# EAGLE schematic sonar_preprocessor (EAGLE 8.3.2)

## Sheet 1 of 7: Amplifier
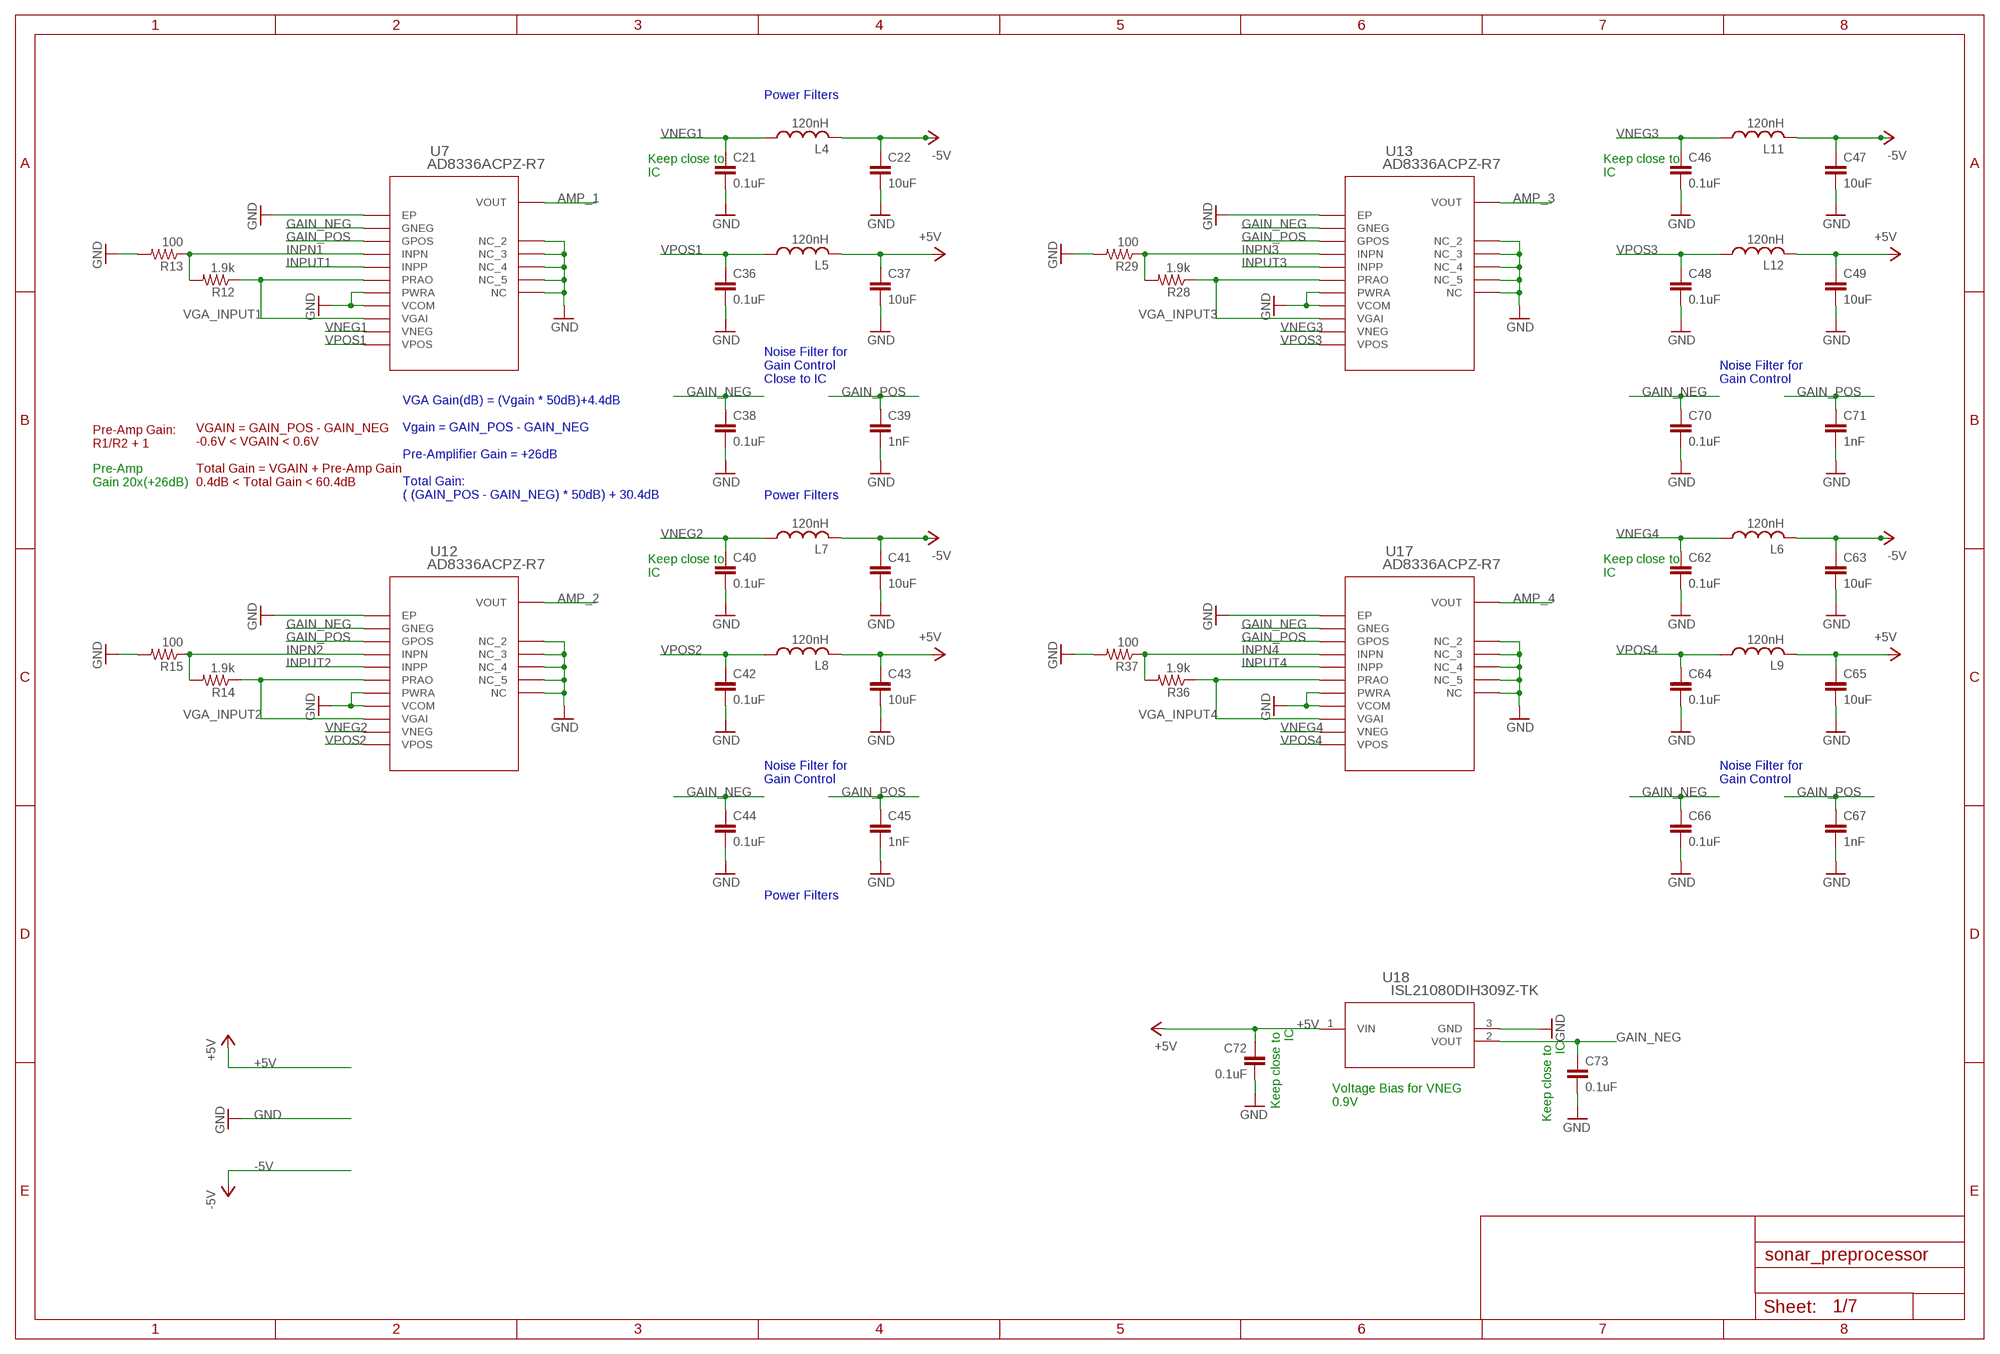
[diagram p0: schematic, sheet 1]

### Parts
C21  0.1uF  C-EUC0603  [C0603]
C22  10uF  C-EUC1206  [C1206]
C36  0.1uF  C-EUC0603  [C0603]
C37  10uF  C-EUC1206  [C1206]
C38  0.1uF  C-EUC0603  [C0603]
C39  1nF  C-EUC0603  [C0603]
C40  0.1uF  C-EUC0603  [C0603]
C41  10uF  C-EUC1206  [C1206]
C42  0.1uF  C-EUC0603  [C0603]
C43  10uF  C-EUC1206  [C1206]
C44  0.1uF  C-EUC0603  [C0603]
C45  1nF  C-EUC0603  [C0603]
C46  0.1uF  C-EUC0603  [C0603]
C47  10uF  C-EUC1206  [C1206]
C48  0.1uF  C-EUC0603  [C0603]
C49  10uF  C-EUC1206  [C1206]
C62  0.1uF  C-EUC0603  [C0603]
C63  10uF  C-EUC1206  [C1206]
C64  0.1uF  C-EUC0603  [C0603]
C65  10uF  C-EUC1206  [C1206]
C66  0.1uF  C-EUC0603  [C0603]
C67  1nF  C-EUC0603  [C0603]
C70  0.1uF  C-EUC0603  [C0603]
C71  1nF  C-EUC0603  [C0603]
C72  0.1uF  C-EUC0603  [C0603]
C73  0.1uF  C-EUC0603  [C0603]
L4  120nH  L-USL3225P  [L3225P]
L5  120nH  L-USL3225P  [L3225P]
L6  120nH  L-USL3225P  [L3225P]
L7  120nH  L-USL3225P  [L3225P]
L8  120nH  L-USL3225P  [L3225P]
L9  120nH  L-USL3225P  [L3225P]
L11  120nH  L-USL3225P  [L3225P]
L12  120nH  L-USL3225P  [L3225P]
R12  1.9k  R-US_R0603  [R0603]
R13  100  R-US_R0603  [R0603]
R14  1.9k  R-US_R0603  [R0603]
R15  100  R-US_R0603  [R0603]
R28  1.9k  R-US_R0603  [R0603]
R29  100  R-US_R0603  [R0603]
R36  1.9k  R-US_R0603  [R0603]
R37  100  R-US_R0603  [R0603]
U7  AD8336ACPZ-R7  [CP_16_4]
U12  AD8336ACPZ-R7  [CP_16_4]
U13  AD8336ACPZ-R7  [CP_16_4]
U17  AD8336ACPZ-R7  [CP_16_4]
U18  ISL21080DIH309Z-TK  [P3_064]

### Nets
+5V: C37.1 C43.1 C49.1 C65.1 C72.1 L5.2 L8.2 L9.2 L12.2 U18.1(VIN) ; also sheet 2,3,4,5,6,7
-5V: C22.1 C41.1 C47.1 C63.1 L4.2 L6.2 L7.2 L11.2 ; also sheet 2,5,6,7
AMP_1: U7.VOUT ; also sheet 2,6
AMP_2: U12.VOUT ; also sheet 2,6
AMP_3: U13.VOUT ; also sheet 2,6
AMP_4: U17.VOUT ; also sheet 2,6
GAIN_NEG: C38.1 C44.1 C66.1 C70.1 C73.1 U7.GNEG U12.GNEG U13.GNEG U17.GNEG U18.2(VOUT)
GAIN_POS: C39.1 C45.1 C67.1 C71.1 U7.GPOS U12.GPOS U13.GPOS U17.GPOS ; also sheet 6
GND: C21.2 C22.2 C36.2 C37.2 C38.2 C39.2 C40.2 C41.2 C42.2 C43.2 C44.2 C45.2 C46.2 C47.2 C48.2 C49.2 C62.2 C63.2 C64.2 C65.2 C66.2 C67.2 C70.2 C71.2 C72.2 C73.2 R13.2 R15.2 R29.2 R37.2 U7.GND1(EP) U7.NC U7.NC1(NC_2) U7.NC2(NC_3) U7.NC3(NC_4) U7.NC4(NC_5) U7.PWRA U7.VCOM U12.GND1(EP) U12.NC U12.NC1(NC_2) U12.NC2(NC_3) U12.NC3(NC_4) U12.NC4(NC_5) U12.PWRA U12.VCOM U13.GND1(EP) U13.NC U13.NC1(NC_2) U13.NC2(NC_3) U13.NC3(NC_4) U13.NC4(NC_5) U13.PWRA U13.VCOM U17.GND1(EP) U17.NC U17.NC1(NC_2) U17.NC2(NC_3) U17.NC3(NC_4) U17.NC4(NC_5) U17.PWRA U17.VCOM U18.3(GND) ; also sheet 2,3,4,5,6,7
INPN1: R12.2 R13.1 U7.INPN
INPN2: R14.2 R15.1 U12.INPN
INPN3: R28.2 R29.1 U13.INPN
INPN4: R36.2 R37.1 U17.INPN
INPUT1: U7.INPP ; also sheet 6,7
INPUT2: U12.INPP ; also sheet 6,7
INPUT3: U13.INPP ; also sheet 6,7
INPUT4: U17.INPP ; also sheet 6,7
VGA_INPUT1: R12.1 U7.PRAO U7.VGAI
VGA_INPUT2: R14.1 U12.PRAO U12.VGAI
VGA_INPUT3: R28.1 U13.PRAO U13.VGAI
VGA_INPUT4: R36.1 U17.PRAO U17.VGAI
VNEG1: C21.1 L4.1 U7.VNEG
VNEG2: C40.1 L7.1 U12.VNEG
VNEG3: C46.1 L11.1 U13.VNEG
VNEG4: C62.1 L6.1 U17.VNEG
VPOS1: C36.1 L5.1 U7.VPOS
VPOS2: C42.1 L8.1 U12.VPOS
VPOS3: C48.1 L12.1 U13.VPOS
VPOS4: C64.1 L9.1 U17.VPOS

### Notes on the sheet
- Power Filters
- Keep close to 
  IC
- Keep close to 
  IC
- Noise Filter for
  Gain Control
  Close to IC
- Noise Filter for
  Gain Control
- Pre-Amp Gain:
  R1/R2 + 1
- Pre-Amp 
  Gain 20x(+26dB)
- VGAIN = GAIN_POS - GAIN_NEG
  -0.6V < VGAIN < 0.6V
  
  Total Gain = VGAIN + Pre-Amp Gain
  0.4dB < Total Gain < 60.4dB
- VGA Gain(dB) = (Vgain * 50dB)+4.4dB
  
  Vgain = GAIN_POS - GAIN_NEG
  
  Pre-Amplifier Gain = +26dB
  
  Total Gain:
  ( (GAIN_POS - GAIN_NEG) * 50dB) + 30.4dB
- Power Filters
- Keep close to 
  IC
- Keep close to 
  IC
- Noise Filter for
  Gain Control
- Noise Filter for
  Gain Control
- Power Filters
- Keep close to 
  IC
- Keep close to 
  IC
- Voltage Bias for VNEG
  0.9V

## Sheet 2 of 7: Filter
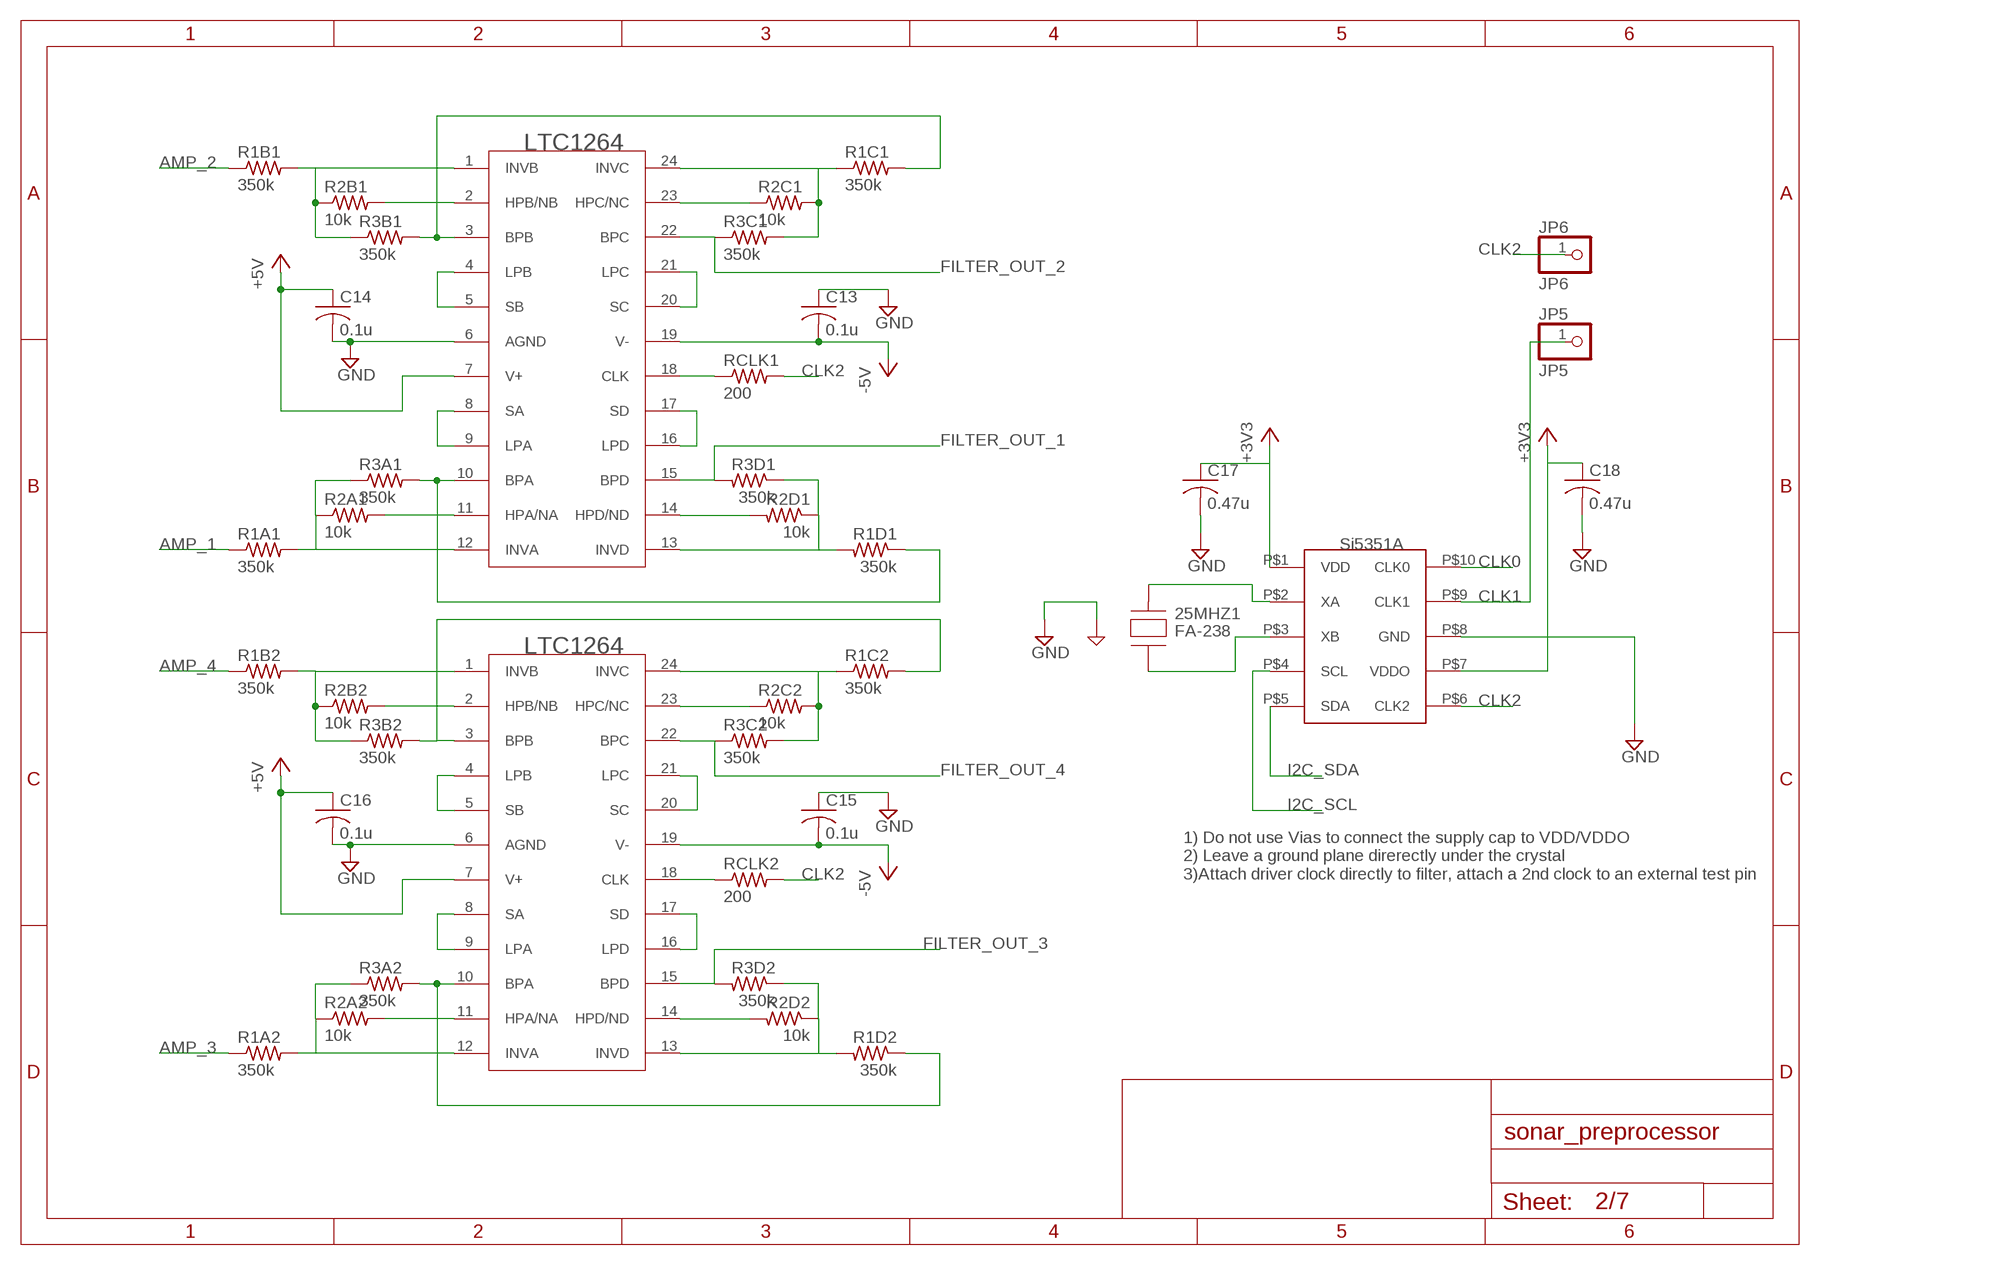
[diagram p1: schematic, sheet 2]

### Parts
25MHZ1  FA-238  [FA-238]
C13  0.1u  C-USC0805  [C0805]
C14  0.1u  C-USC0805  [C0805]
C15  0.1u  C-USC0805  [C0805]
C16  0.1u  C-USC0805  [C0805]
C17  0.47u  C-USC0805  [C0805]
C18  0.47u  C-USC0805  [C0805]
JP5  JP5  PINHD-1X1  [1X01]
JP6  JP6  PINHD-1X1  [1X01]
R1A1  350k  R-US_R0805  [R0805]
R1A2  350k  R-US_R0805  [R0805]
R1B1  350k  R-US_R0805  [R0805]
R1B2  350k  R-US_R0805  [R0805]
R1C1  350k  R-US_R0805  [R0805]
R1C2  350k  R-US_R0805  [R0805]
R1D1  350k  R-US_R0805  [R0805]
R1D2  350k  R-US_R0805  [R0805]
R2A1  10k  R-US_R0805  [R0805]
R2A2  10k  R-US_R0805  [R0805]
R2B1  10k  R-US_R0805  [R0805]
R2B2  10k  R-US_R0805  [R0805]
R2C1  10k  R-US_R0805  [R0805]
R2C2  10k  R-US_R0805  [R0805]
R2D1  10k  R-US_R0805  [R0805]
R2D2  10k  R-US_R0805  [R0805]
R3A1  350k  R-US_R0805  [R0805]
R3A2  350k  R-US_R0805  [R0805]
R3B1  350k  R-US_R0805  [R0805]
R3B2  350k  R-US_R0805  [R0805]
R3C1  350k  R-US_R0805  [R0805]
R3C2  350k  R-US_R0805  [R0805]
R3D1  350k  R-US_R0805  [R0805]
R3D2  350k  R-US_R0805  [R0805]
RCLK1  200  R-US_R0805  [R0805]
RCLK2  200  R-US_R0805  [R0805]
U$6  LTC1264SMD  [SO24W]
U$7  LTC1264SMD  [SO24W]
U$8  SI5351A  [MSOP-10]

### Nets
+3V3: C17.1 C18.1 U$8.P$1(VDD) U$8.P$7(VDDO) ; also sheet 6
+5V: C14.1 C16.1 U$6.7(V+) U$7.7(V+) ; also sheet 1,3,4,5,6,7
-5V: C13.2 C15.2 U$6.19(V-) U$7.19(V-) ; also sheet 1,5,6,7
AMP_1: R1A1.1 ; also sheet 1,6
AMP_2: R1B1.1 ; also sheet 1,6
AMP_3: R1A2.1 ; also sheet 1,6
AMP_4: R1B2.1 ; also sheet 1,6
CLK0: U$8.P$10(CLK0)
CLK1: JP5.1 U$8.P$9(CLK1)
CLK2: JP6.1 RCLK1.2 RCLK2.2 U$8.P$6(CLK2)
FILTER_OUT_1: R3D1.2 U$6.15(BPD) ; also sheet 3,6
FILTER_OUT_2: R3C1.1 U$6.22(BPC) ; also sheet 3,6
FILTER_OUT_3: R3D2.2 U$7.15(BPD) ; also sheet 3,6
FILTER_OUT_4: R3C2.1 U$7.22(BPC) ; also sheet 3,6
GND: 25MHZ1.P$1(GND) 25MHZ1.P$3(GND) C13.1 C14.2 C15.1 C16.2 C17.2 C18.2 U$6.6(AGND) U$7.6(AGND) U$8.P$8(GND) ; also sheet 1,3,4,5,6,7
I2C_SCL: U$8.P$4(SCL) ; also sheet 6
I2C_SDA: U$8.P$5(SDA) ; also sheet 6
N$7: U$7.20(SC) U$7.21(LPC)
N$9: 25MHZ1.P$4(XA) U$8.P$2(XA)
N$10: 25MHZ1.P$2(XB) U$8.P$3(XB)
N$24: R2A1.2 U$6.11(HPA/NA)
N$25: U$6.8(SA) U$6.9(LPA)
N$26: R1A1.2 R2A1.1 R3A1.1 U$6.12(INVA)
N$27: R2D1.2 U$6.14(HPD/ND)
N$28: R1D1.2 R2D1.1 R3D1.1 U$6.13(INVD)
N$29: U$6.16(LPD) U$6.17(SD)
N$30: R2C1.1 U$6.23(HPC/NC)
N$31: R1C1.1 R2C1.2 R3C1.2 U$6.24(INVC)
N$32: R2C2.1 U$7.23(HPC/NC)
N$33: R2B1.2 U$6.2(HPB/NB)
N$34: R1B1.2 R2B1.1 R3B1.1 U$6.1(INVB)
N$35: U$6.4(LPB) U$6.5(SB)
N$36: U$6.20(SC) U$6.21(LPC)
N$37: RCLK1.1 U$6.18(CLK)
N$38: R2A2.2 U$7.11(HPA/NA)
N$39: U$7.8(SA) U$7.9(LPA)
N$40: R1A2.2 R2A2.1 R3A2.1 U$7.12(INVA)
N$41: R2D2.2 U$7.14(HPD/ND)
N$42: R1D2.2 R2D2.1 R3D2.1 U$7.13(INVD)
N$43: U$7.16(LPD) U$7.17(SD)
N$44: R1C2.1 R2C2.2 R3C2.2 U$7.24(INVC)
N$46: R2B2.2 U$7.2(HPB/NB)
N$47: R1B2.2 R2B2.1 R3B2.1 U$7.1(INVB)
N$48: U$7.4(LPB) U$7.5(SB)
N$50: RCLK2.1 U$7.18(CLK)
OUT_2ND_A1: R1D1.1 R3A1.2 U$6.10(BPA)
OUT_2ND_A2: R1D2.1 R3A2.2 U$7.10(BPA)
OUT_2ND_B2: R1C2.2 R3B2.2 U$7.3(BPB)
OUT_2ND_ORDER_B1: R1C1.2 R3B1.2 U$6.3(BPB)

### Notes on the sheet
- 1) Do not use Vias to connect the supply cap to VDD/VDDO
  2) Leave a ground plane direrectly under the crystal
  3)Attach driver clock directly to filter, attach a 2nd clock to an external test pin

## Sheet 3 of 7: Bias_and_Clamp
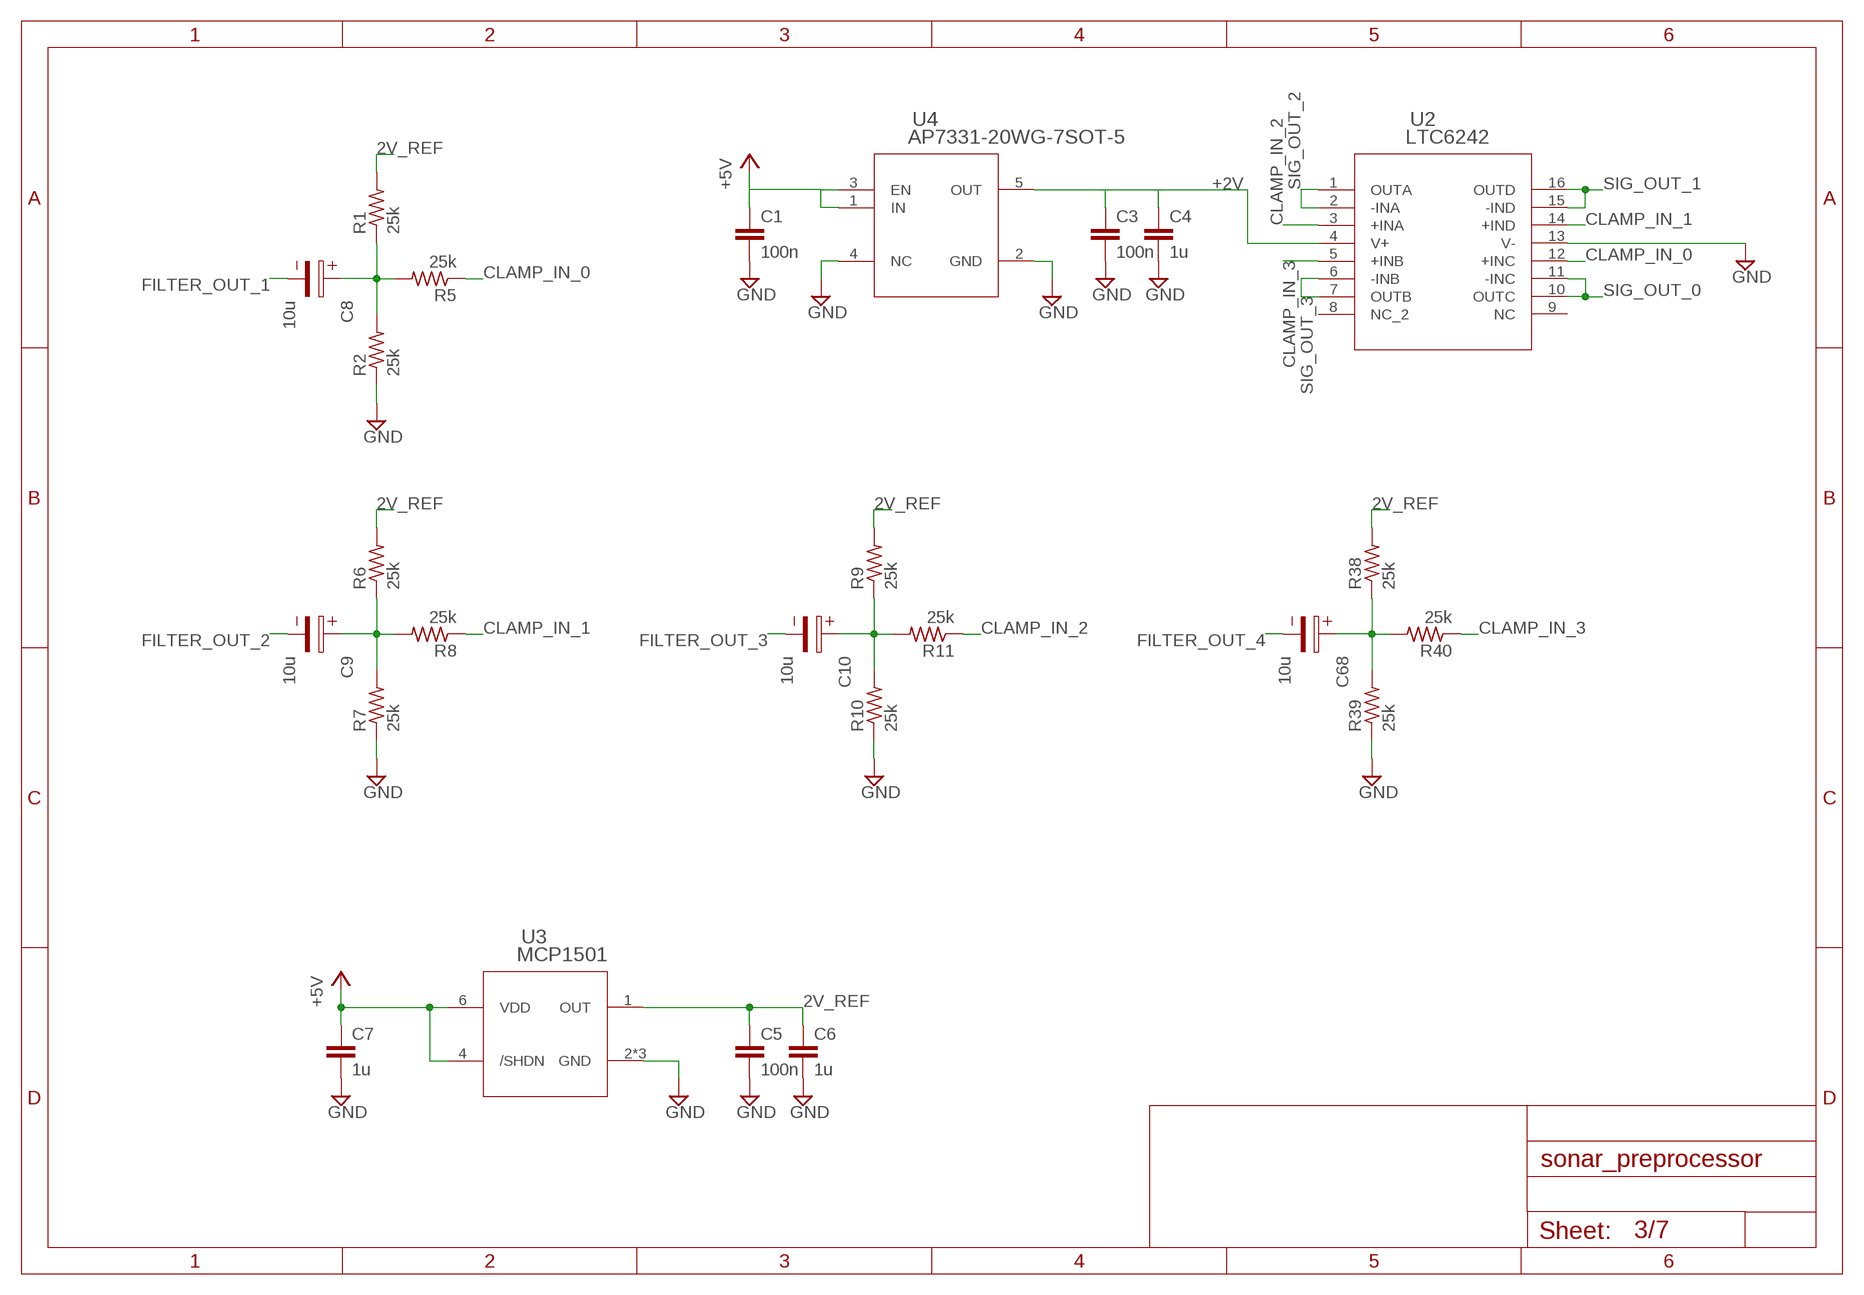
[diagram p2: schematic, sheet 3]

### Parts
C1  100n  C-EUC0805  [C0805]
C3  100n  C-EUC0805  [C0805]
C4  1u  C-EUC0805  [C0805]
C5  100n  C-EUC0805  [C0805]
C6  1u  C-EUC0805  [C0805]
C7  1u  C-EUC0805  [C0805]
C8  10u  WCAP-AS5H_4X5,5_865230340001  [2.6X1.6X1(BXCXA)]
C9  10u  WCAP-AS5H_4X5,5_865230340001  [2.6X1.6X1(BXCXA)]
C10  10u  WCAP-AS5H_4X5,5_865230340001  [2.6X1.6X1(BXCXA)]
C68  10u  WCAP-AS5H_4X5,5_865230340001  [2.6X1.6X1(BXCXA)]
R1  25k  R-US_R0805  [R0805]
R2  25k  R-US_R0805  [R0805]
R5  25k  R-US_R0805  [R0805]
R6  25k  R-US_R0805  [R0805]
R7  25k  R-US_R0805  [R0805]
R8  25k  R-US_R0805  [R0805]
R9  25k  R-US_R0805  [R0805]
R10  25k  R-US_R0805  [R0805]
R11  25k  R-US_R0805  [R0805]
R38  25k  R-US_R0805  [R0805]
R39  25k  R-US_R0805  [R0805]
R40  25k  R-US_R0805  [R0805]
U2  LTC6242  LTC6242IGNPBFSSOP16  [SSOP16]
U3  MCP1501  [SOT23-6]
U4  AP7331-20WG-7SOT-5  [SOT23-5]

### Nets
2V_REF: C5.1 C6.1 R1.2 R6.2 R9.2 R38.2 U3.1(OUT)
+2V: C3.1 C4.1 U2.4(V+) U4.5(OUT)
+5V: C1.1 C7.1 U3.4(/SHDN) U3.6(VDD) U4.1(IN) U4.3(EN) ; also sheet 1,2,4,5,6,7
BIASED_0: C8.1 R1.1 R2.2 R5.2
BIASED_1: C9.1 R6.1 R7.2 R8.2
BIASED_2: C10.1 R9.1 R10.2 R11.2
BIASED_3: C68.1 R38.1 R39.2 R40.2
CLAMP_IN_0: R5.1 U2.12(+INC)
CLAMP_IN_1: R8.1 U2.14(+IND)
CLAMP_IN_2: R11.1 U2.3(+INA)
CLAMP_IN_3: R40.1 U2.5(+INB)
FILTER_OUT_1: C8.2 ; also sheet 2,6
FILTER_OUT_2: C9.2 ; also sheet 2,6
FILTER_OUT_3: C10.2 ; also sheet 2,6
FILTER_OUT_4: C68.2 ; also sheet 2,6
GND: C1.2 C3.2 C4.2 C5.2 C6.2 C7.2 R2.1 R7.1 R10.1 R39.1 U2.13(V-) U4.2(GND) U4.4(NC) ; also sheet 1,2,4,5,6,7
SIG_OUT_0: U2.10(OUTC) U2.11(-INC) ; also sheet 6
SIG_OUT_1: U2.15(-IND) U2.16(OUTD) ; also sheet 6
SIG_OUT_2: U2.1(OUTA) U2.2(-INA) ; also sheet 4,6
SIG_OUT_3: U2.6(-INB) U2.7(OUTB) ; also sheet 6
Unconnected: U2.8(NC_2) U2.9(NC)

## Sheet 4 of 7: Peak Detector
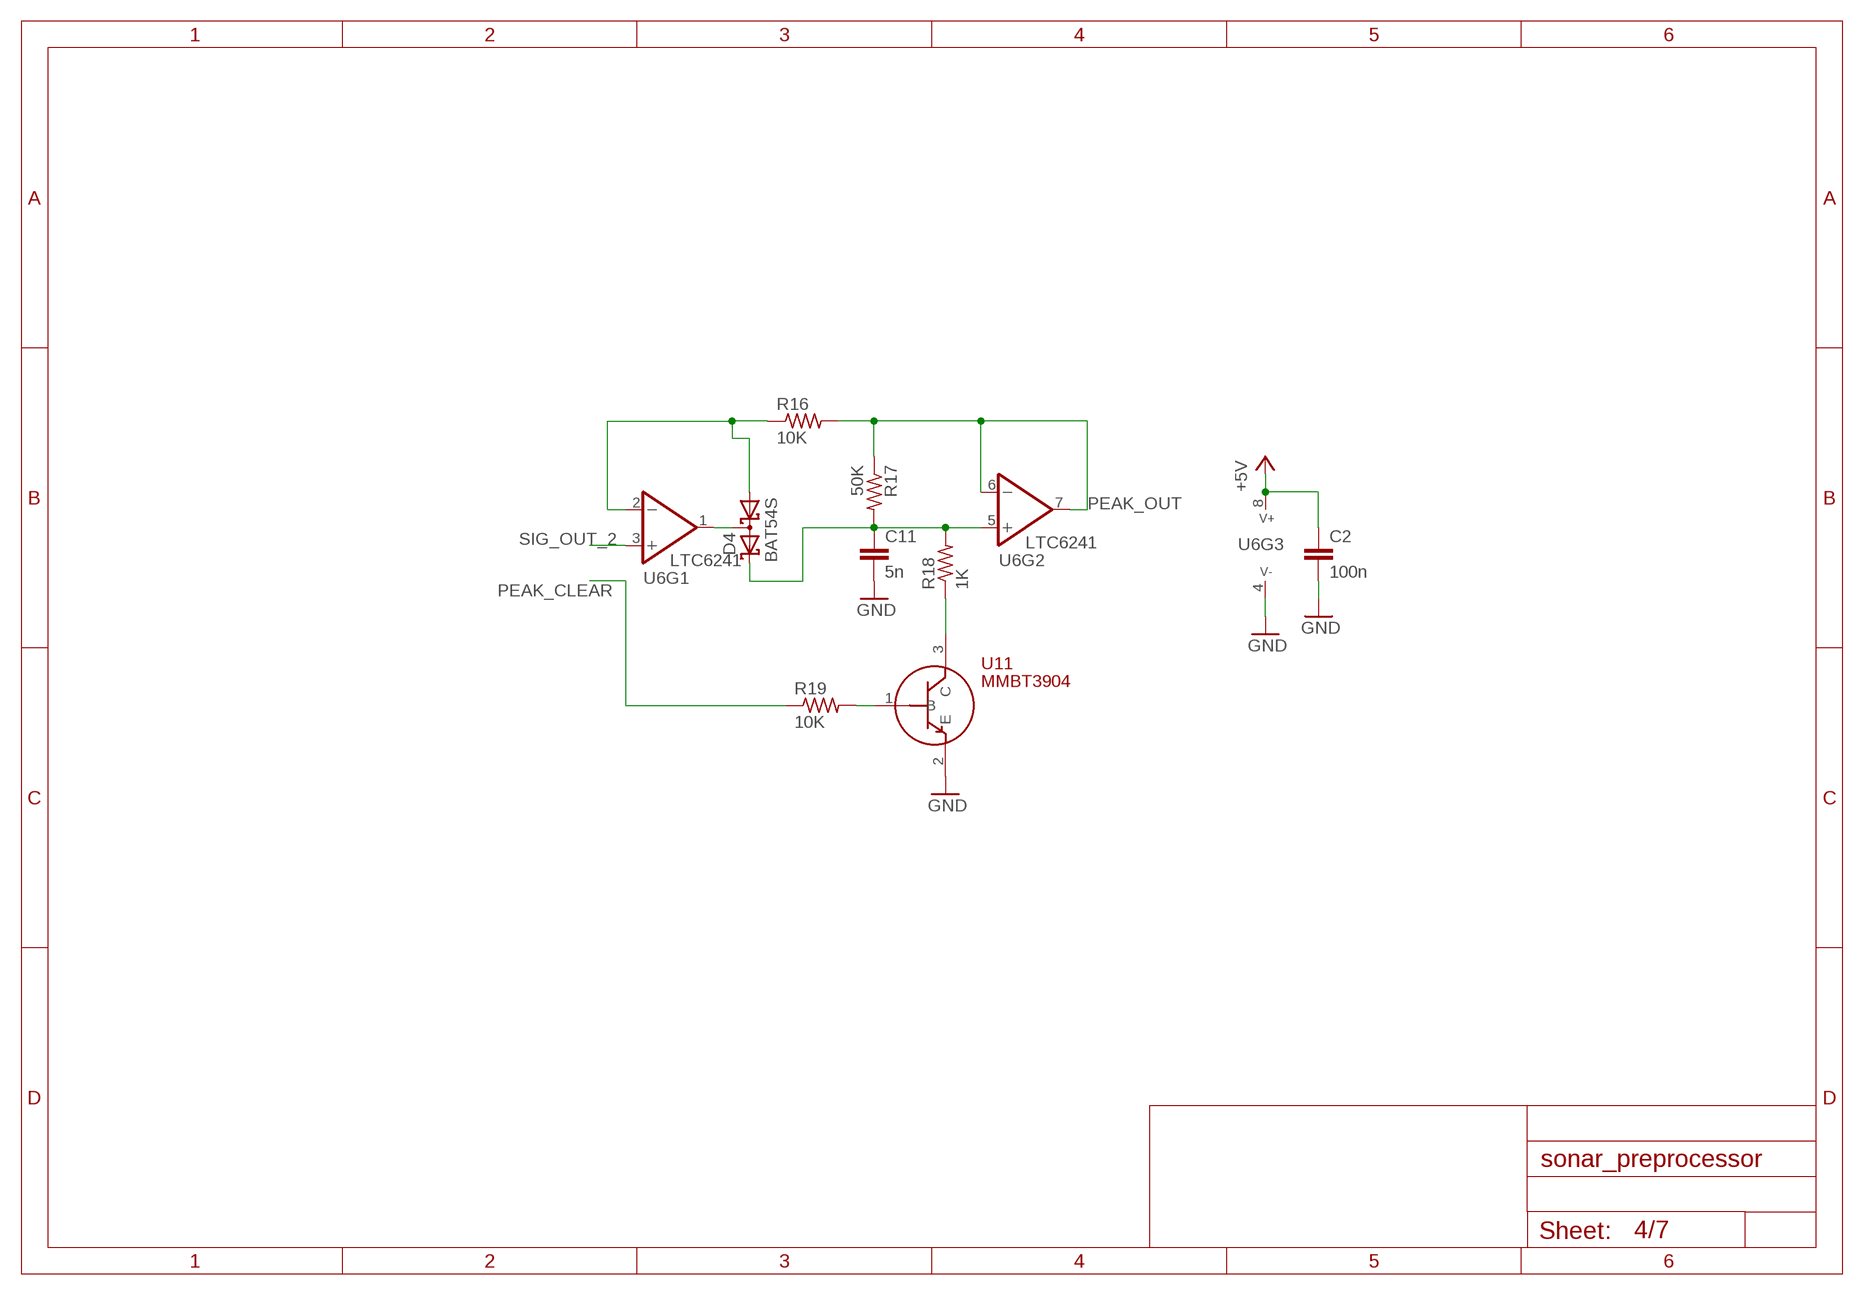
[diagram p3: schematic, sheet 4]

### Parts
C2  100n  C-EUC0805  [C0805]
C11  5n  C-EUC0805  [C0805]
D4  BAT54S  [SOT23]
R16  10K  R-US_R0805  [R0805]
R17  50K  R-US_R0805  [R0805]
R18  1K  R-US_R0805  [R0805]
R19  10K  R-US_R0805  [R0805]
U6  LTC6241  [SO-8]
U11  MMBT3904  [SOT23]

### Nets
+5V: C2.1 U6.8(V+) ; also sheet 1,2,3,5,6,7
GND: C2.2 C11.2 U6.4(V-) U11.2(E) ; also sheet 1,2,3,5,6,7
N$12: C11.1 D4.2(C2) R17.2 R18.2 U6.5(+IN)
N$13: D4.1(A1) R16.1 U6.2(-IN)
N$14: D4.3(C1A2) U6.1(OUT)
N$15: R19.2 U11.1(B)
N$16: R18.1 U11.3(C)
PEAK_CLEAR: R19.1 ; also sheet 6
PEAK_OUT: R16.2 R17.1 U6.6(-IN) U6.7(OUT) ; also sheet 6
SIG_OUT_2: U6.3(+IN) ; also sheet 3,6

## Sheet 5 of 7: Power_Supply
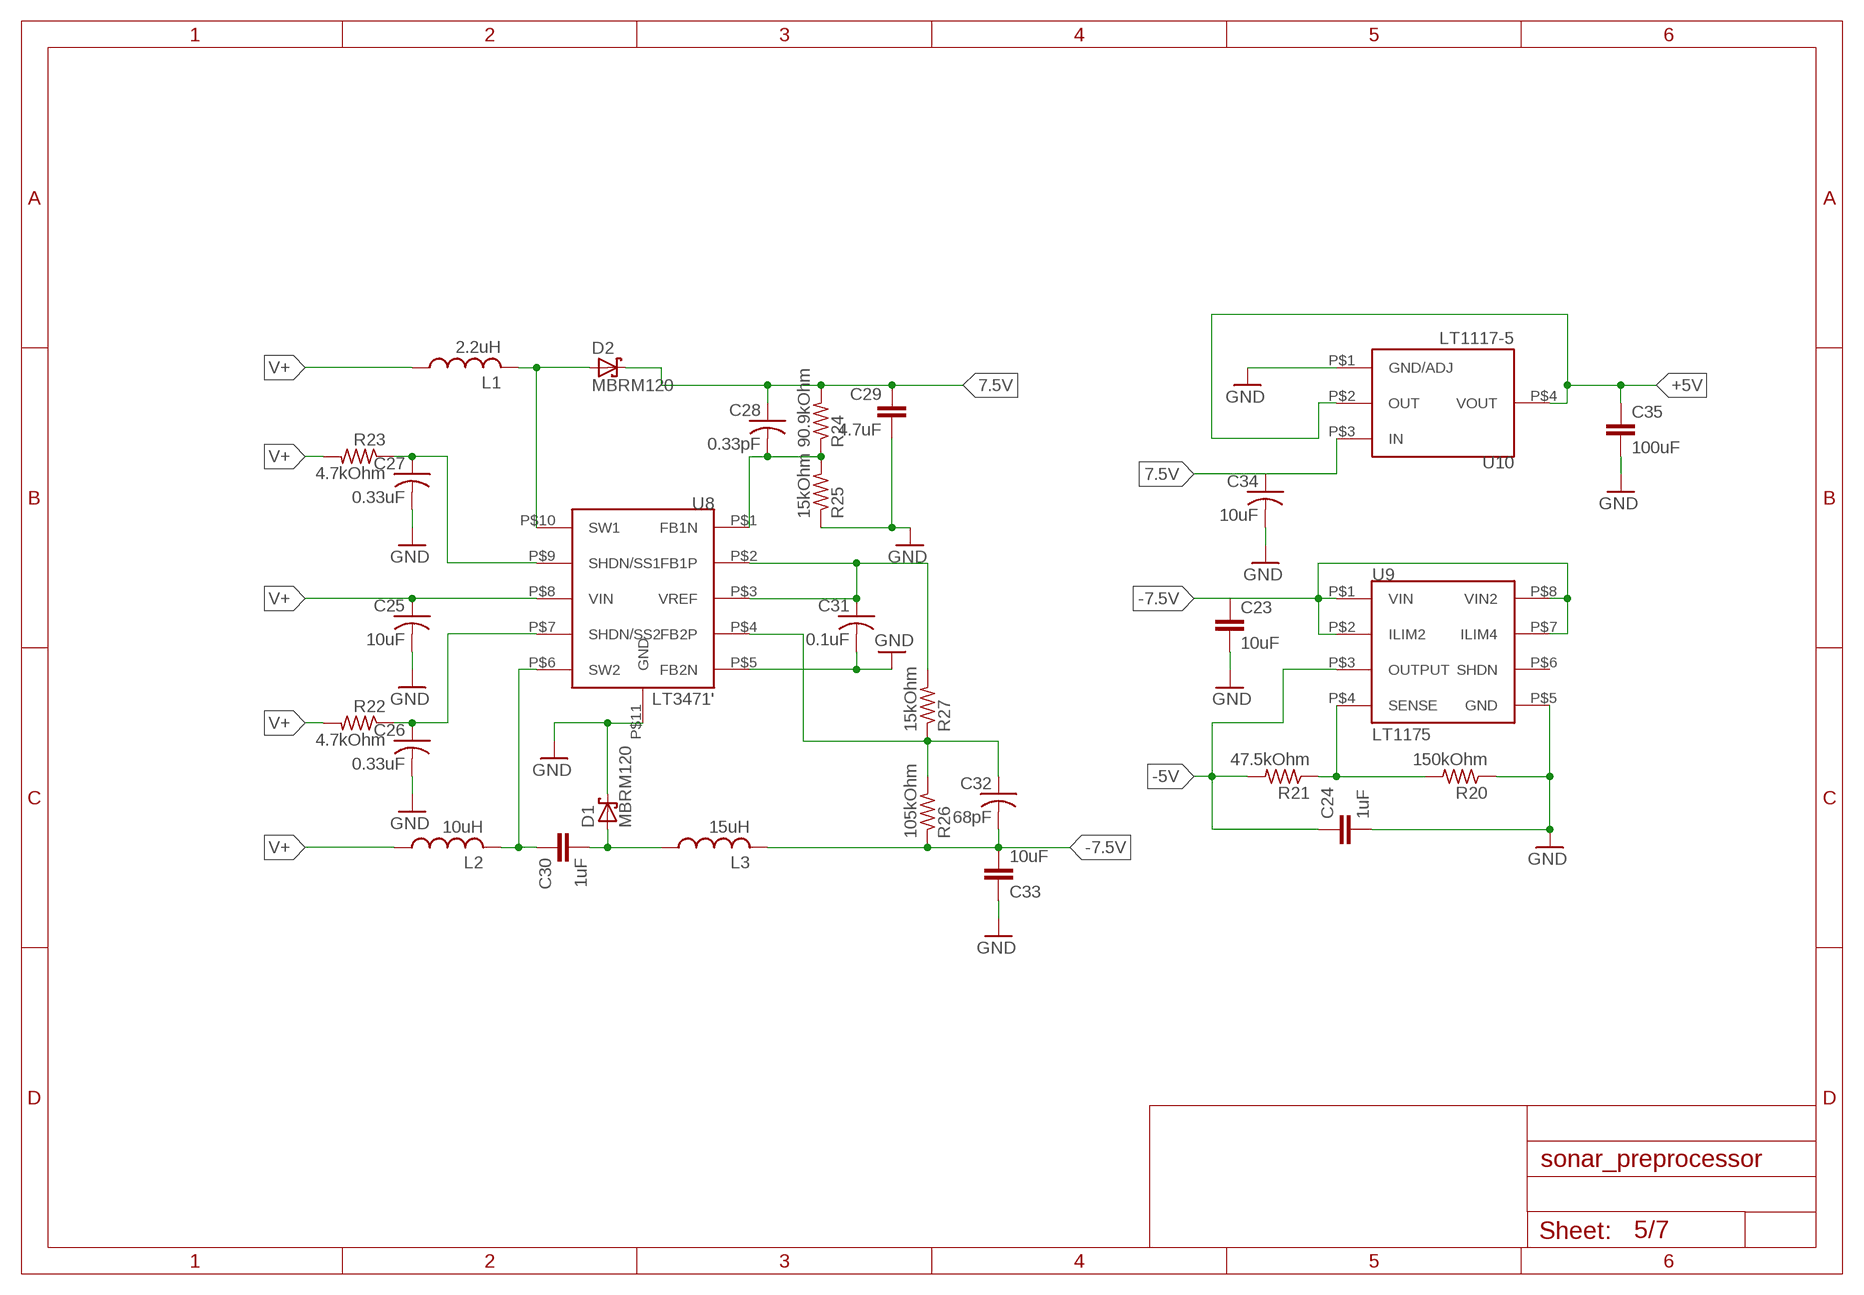
[diagram p4: schematic, sheet 5]

### Parts
C23  10uF  C-EUC0805  [C0805]
C24  1uF  C-EUC1206  [C1206]
C25  10uF  C-USC0603  [C0603]
C26  0.33uF  C-USC0603  [C0603]
C27  0.33uF  C-USC0603  [C0603]
C28  0.33pF  C-USC0603  [C0603]
C29  4.7uF  C-EUC1206  [C1206]
C30  1uF  C-EUC1206  [C1206]
C31  0.1uF  C-USC0603  [C0603]
C32  68pF  C-USC0603  [C0603]
C33  10uF  C-EUC0805  [C0805]
C34  10uF  C-USC0603  [C0603]
C35  100uF  C-EUC1210  [C1210]
D1  MBRM120  [DO-216AA]
D2  MBRM120  [DO-216AA]
L1  2.2uH  LQH5BPN2R2N38L  [NS4.9X4.9]
L2  10uH  VLS5045EX-100M2  [NS5X5]
L3  15uH  VLS5045EX-150M-CA1  [NS5X5]
R20  150kOhm  R-US_R0603  [R0603]
R21  47.5kOhm  R-US_R0603  [R0603]
R22  4.7kOhm  R-US_R0603  [R0603]
R23  4.7kOhm  R-US_R0603  [R0603]
R24  90.9kOhm  R-US_R0603  [R0603]
R25  15kOhm  R-US_R0603  [R0603]
R26  105kOhm  R-US_R0603  [R0603]
R27  15kOhm  R-US_R0603  [R0603]
U8  LT3471'  [10-WFDFN]
U9  LT1175  [8-SOIC]
U10  LT1117-5  [SOT233-3]

### Nets
7.5V: C28.1 C29.1 C34.1 D2.P$1(C) R24.2 U10.P$3(IN)
+5V: C35.1 U10.P$2(OUT) U10.P$4(VOUT) ; also sheet 1,2,3,4,6,7
-5V: C24.1 R21.2 U9.P$3(OUTPUT) ; also sheet 1,2,6,7
-7.5V: C23.1 C32.2 C33.2 L3.P$2 R26.1 U9.P$1(VIN) U9.P$2(ILIM2) U9.P$7(ILIM4) U9.P$8(VIN2)
GND: C23.2 C24.2 C25.2 C26.2 C27.2 C29.2 C31.2 C33.1 C34.2 C35.2 D1.P$1(C) R20.1 R25.1 U8.P$5(FB2N) U8.P$11(GND) U9.P$5(GND) U10.P$1(GND/ADJ) ; also sheet 1,2,3,4,6,7
N$1: R20.2 R21.1 U9.P$4(SENSE)
N$2: D2.P$2(A) L1.P$2 U8.P$10(SW1)
N$3: C28.2 R24.1 R25.2 U8.P$1(FB1N)
N$4: C30.1 L2.P$2 U8.P$6(SW2)
N$5: C30.2 D1.P$2(A) L3.P$1
N$6: C32.1 R26.2 R27.1 U8.P$4(FB2P)
SS3: C26.1 R22.1 U8.P$7(SHDN/SS2)
SS4: C27.1 R23.1 U8.P$9(SHDN/SS1)
V+: C25.1 L1.P$1 L2.P$1 R22.2 R23.2 U8.P$8(VIN) ; also sheet 6
VREF: C31.1 R27.2 U8.P$2(FB1P) U8.P$3(VREF)
Unconnected: U9.P$6(SHDN)

## Sheet 6 of 7: Microcontroller and General Interconnect
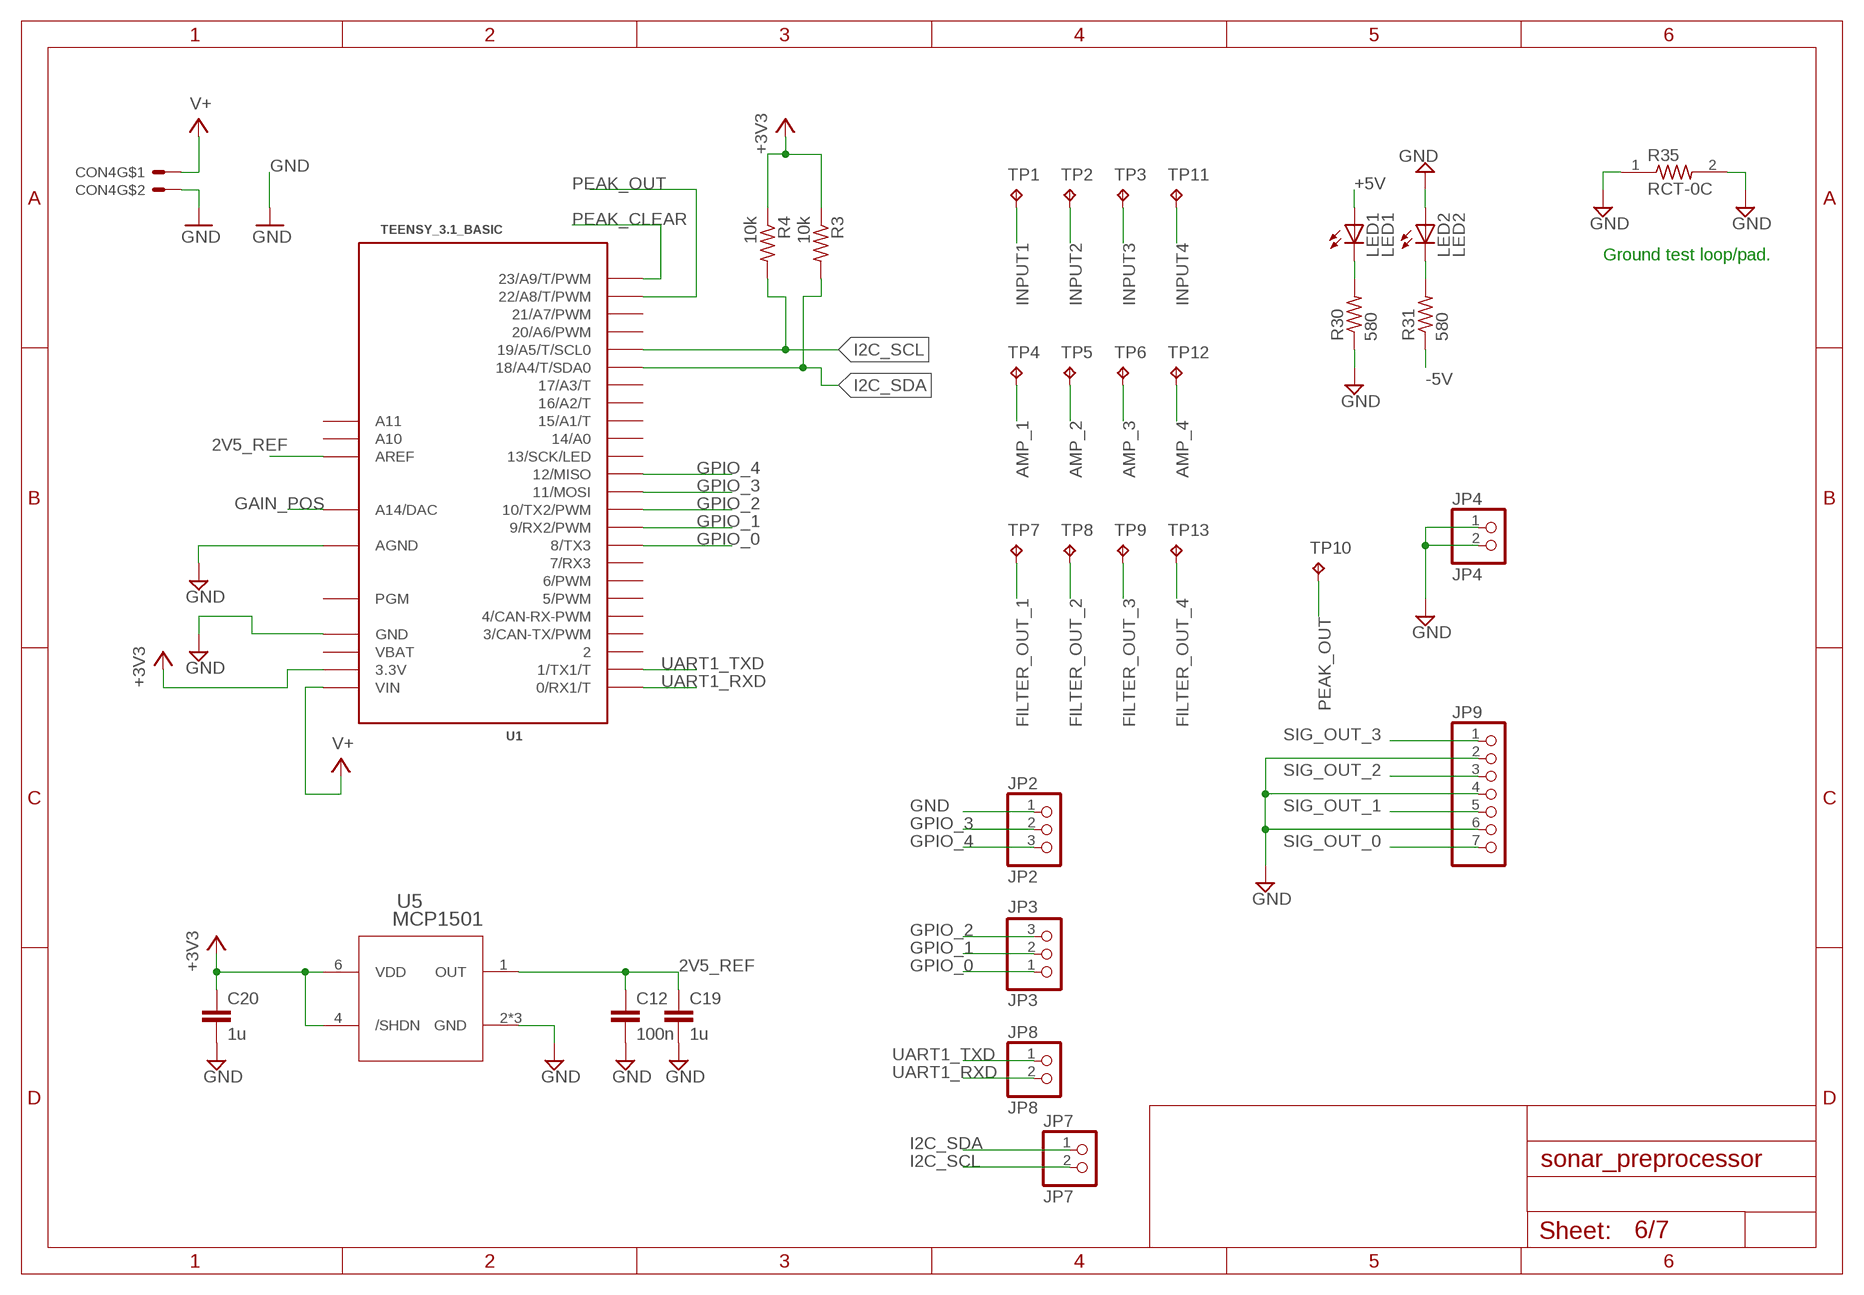
[diagram p5: schematic, sheet 6]

### Parts
C12  100n  C-EUC0805  [C0805]
C19  1u  C-EUC0805  [C0805]
C20  1u  C-EUC0805  [C0805]
CON4  MOLEX_5566-2  [5566-2]
JP2  JP2  PINHD-1X03_2.54-SMD-90°  [1X03SMD/90]
JP3  JP3  PINHD-1X03_2.54-SMD-90°  [1X03SMD/90]
JP4  JP4  PINHD-1X2  [1X02]
JP7  JP7  PINHD-1X2  [1X02]
JP8  JP8  PINHD-1X02_2.54-SMD-90°  [1X02SMD/90]
JP9  PINHD-1X7/90  [1X07/90]
LED1  LED1  LEDSML0805  [SML0805]
LED2  LED2  LEDSML0805  [SML0805]
R3  10k  R-US_R0805  [R0805]
R4  10k  R-US_R0805  [R0805]
R30  580  R-US_R0805  [R0805]
R31  580  R-US_R0805  [R0805]
R35  RCT-0C  [RESC2012X65N]
TP1  TPB2,54  [B2,54]
TP2  TPB2,54  [B2,54]
TP3  TPB2,54  [B2,54]
TP4  TPB2,54  [B2,54]
TP5  TPB2,54  [B2,54]
TP6  TPB2,54  [B2,54]
TP7  TPB2,54  [B2,54]
TP8  TPB2,54  [B2,54]
TP9  TPB2,54  [B2,54]
TP10  TPB2,54  [B2,54]
TP11  TPB2,54  [B2,54]
TP12  TPB2,54  [B2,54]
TP13  TPB2,54  [B2,54]
U1  TEENSY_3.1_BASIC  [TEENSY_3.1_BASIC]
U5  MCP1501  [SOT23-6]

### Nets
2V5_REF: C12.1 C19.1 U1.AREF U5.1(OUT)
+3V3: C20.1 R3.1 R4.1 U1.3.3V U1.3.3V1(3.3V) U5.4(/SHDN) U5.6(VDD) ; also sheet 2
+5V: LED1.A ; also sheet 1,2,3,4,5,7
-5V: R31.1 ; also sheet 1,2,5,7
AMP_1: TP4.TP ; also sheet 1,2
AMP_2: TP5.TP ; also sheet 1,2
AMP_3: TP6.TP ; also sheet 1,2
AMP_4: TP12.TP ; also sheet 1,2
FILTER_OUT_1: TP7.TP ; also sheet 2,3
FILTER_OUT_2: TP8.TP ; also sheet 2,3
FILTER_OUT_3: TP9.TP ; also sheet 2,3
FILTER_OUT_4: TP13.TP ; also sheet 2,3
GAIN_POS: U1.A14(A14/DAC) ; also sheet 1
GND: C12.2 C19.2 C20.2 CON4.2 JP2.1 JP4.1 JP4.2 JP9.2 JP9.4 JP9.6 LED2.A R30.1 R35.1 R35.2 U1.AGND U1.GND U1.GND1(GND) U5.2(GND) U5.3(GND) U5.5(GND) ; also sheet 1,2,3,4,5,7
GPIO_0: JP3.1 U1.8(8/TX3)
GPIO_1: JP3.2 U1.9(9/RX2/PWM)
GPIO_2: JP3.3 U1.10(10/TX2/PWM)
GPIO_3: JP2.2 U1.11(11/MOSI)
GPIO_4: JP2.3 U1.12(12/MISO)
I2C_SCL: JP7.2 R4.2 U1.19/A5(19/A5/T/SCL0) ; also sheet 2
I2C_SDA: JP7.1 R3.2 U1.18/A4(18/A4/T/SDA0) ; also sheet 2
INPUT1: TP1.TP ; also sheet 1,7
INPUT2: TP2.TP ; also sheet 1,7
INPUT3: TP3.TP ; also sheet 1,7
INPUT4: TP11.TP ; also sheet 1,7
N$11: LED2.C R31.2
N$17: LED1.C R30.2
PEAK_CLEAR: U1.23/A9(23/A9/T/PWM) ; also sheet 4
PEAK_OUT: TP10.TP U1.22/A8(22/A8/T/PWM) ; also sheet 4
SIG_OUT_0: JP9.7 ; also sheet 3
SIG_OUT_1: JP9.5 ; also sheet 3
SIG_OUT_2: JP9.3 ; also sheet 3,4
SIG_OUT_3: JP9.1 ; also sheet 3
UART1_RXD: JP8.2 U1.0(0/RX1/T)
UART1_TXD: JP8.1 U1.1(1/TX1/T)
V+: CON4.1 U1.VIN ; also sheet 5
Unconnected: U1.2 U1.3(3/CAN-TX/PWM) U1.4(4/CAN-RX-PWM) U1.5(5/PWM) U1.6(6/PWM) U1.7(7/RX3) U1.13(13/SCK/LED) U1.14/A0 U1.15/A1(15/A1/T) U1.16/A2(16/A2/T) U1.17/A3(17/A3/T) U1.20/A6(20/A6/PWM) U1.21/A7(21/A7/PWM) U1.A10 U1.A11 U1.PGM

### Notes on the sheet
- Ground test loop/pad.

## Sheet 7 of 7: Input Buffer
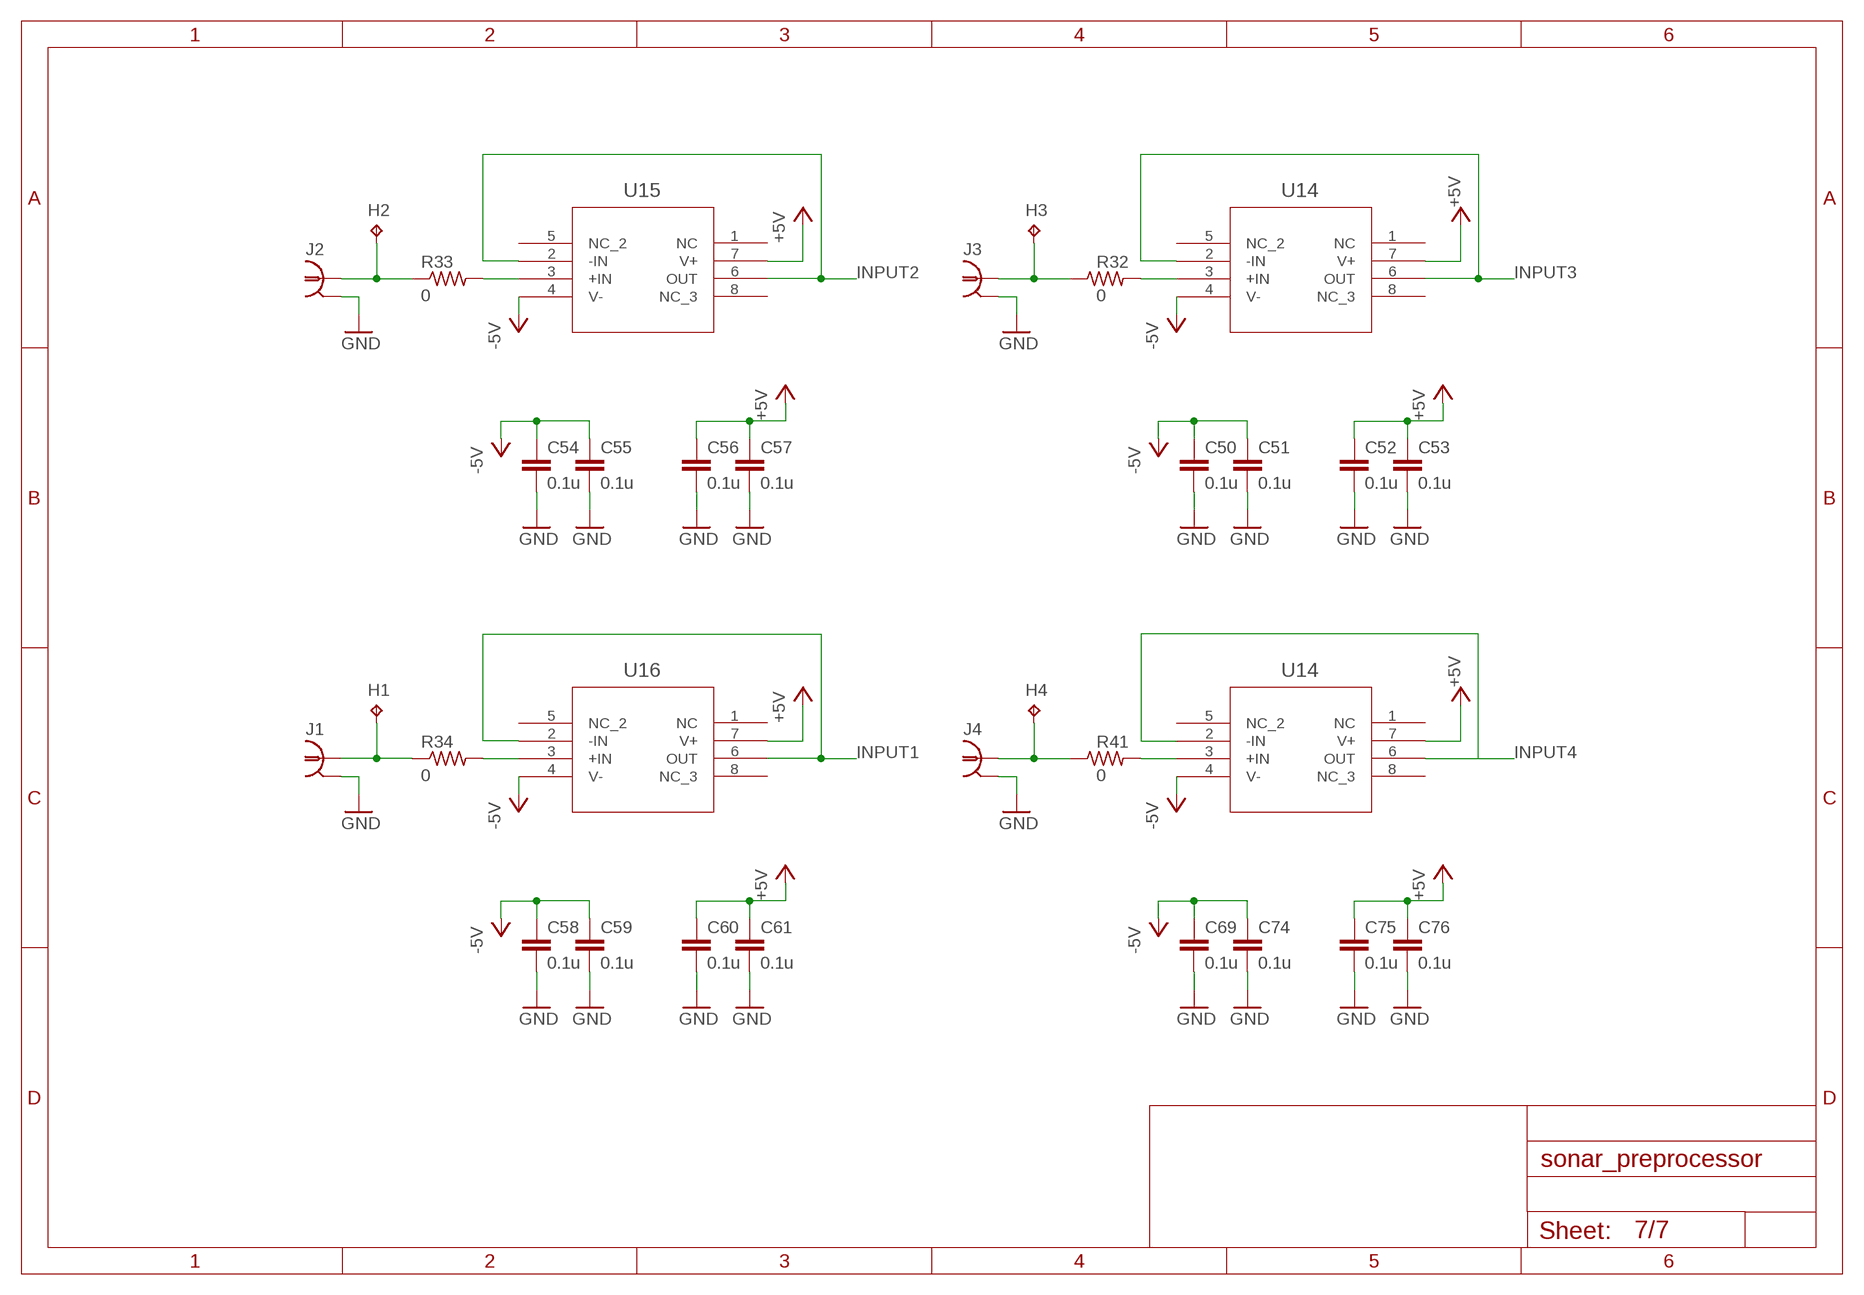
[diagram p6: schematic, sheet 7]

### Parts
C50  0.1u  C-EUC0603  [C0603]
C51  0.1u  C-EUC0603  [C0603]
C52  0.1u  C-EUC0603  [C0603]
C53  0.1u  C-EUC0603  [C0603]
C54  0.1u  C-EUC0603  [C0603]
C55  0.1u  C-EUC0603  [C0603]
C56  0.1u  C-EUC0603  [C0603]
C57  0.1u  C-EUC0603  [C0603]
C58  0.1u  C-EUC0603  [C0603]
C59  0.1u  C-EUC0603  [C0603]
C60  0.1u  C-EUC0603  [C0603]
C61  0.1u  C-EUC0603  [C0603]
C69  0.1u  C-EUC0603  [C0603]
C74  0.1u  C-EUC0603  [C0603]
C75  0.1u  C-EUC0603  [C0603]
C76  0.1u  C-EUC0603  [C0603]
H1  TPB2,54  [B2,54]
H2  TPB2,54  [B2,54]
H3  TPB2,54  [B2,54]
H4  TPB2,54  [B2,54]
J1  TE_5-1634503-1TE  [TE_5-1634503-1]
J2  TE_5-1634503-1TE  [TE_5-1634503-1]
J3  TE_5-1634503-1TE  [TE_5-1634503-1]
J4  TE_5-1634503-1TE  [TE_5-1634503-1]
R32  0  R-US_R0603  [R0603]
R33  0  R-US_R0603  [R0603]
R34  0  R-US_R0603  [R0603]
R41  0  R-US_R0603  [R0603]
U14  U14  LTC6240SO-8  [SO-8]
U15  U15  LTC6240SO-8  [SO-8]
U16  U16  LTC6240SO-8  [SO-8]
U19  U14  LTC6240SO-8  [SO-8]

### Nets
+5V: C52.1 C53.1 C56.1 C57.1 C60.1 C61.1 C75.1 C76.1 U14.7(V+) U15.7(V+) U16.7(V+) U19.7(V+) ; also sheet 1,2,3,4,5,6
-5V: C50.1 C51.1 C54.1 C55.1 C58.1 C59.1 C69.1 C74.1 U14.4(V-) U15.4(V-) U16.4(V-) U19.4(V-) ; also sheet 1,2,5,6
GND: C50.2 C51.2 C52.2 C53.2 C54.2 C55.2 C56.2 C57.2 C58.2 C59.2 C60.2 C61.2 C69.2 C74.2 C75.2 C76.2 J1.2 J1.3 J1.4 J1.5 J2.2 J2.3 J2.4 J2.5 J3.2 J3.3 J3.4 J3.5 J4.2 J4.3 J4.4 J4.5 ; also sheet 1,2,3,4,5,6
INPUT1: U16.2(-IN) U16.6(OUT) ; also sheet 1,6
INPUT2: U15.2(-IN) U15.6(OUT) ; also sheet 1,6
INPUT3: U14.2(-IN) U14.6(OUT) ; also sheet 1,6
INPUT4: U19.2(-IN) U19.6(OUT) ; also sheet 1,6
N$8: H4.TP J4.1 R41.1
N$18: H3.TP J3.1 R32.1
N$19: R32.2 U14.3(+IN)
N$20: H2.TP J2.1 R33.1
N$21: R33.2 U15.3(+IN)
N$22: R34.2 U16.3(+IN)
N$23: H1.TP J1.1 R34.1
N$45: R41.2 U19.3(+IN)
Unconnected: U14.1(NC) U14.5(NC_2) U14.8(NC_3) U15.1(NC) U15.5(NC_2) U15.8(NC_3) U16.1(NC) U16.5(NC_2) U16.8(NC_3) U19.1(NC) U19.5(NC_2) U19.8(NC_3)

## Power pins joined to a net without a drawn wire
GND: U3.2(GND) U3.3(GND) U3.5(GND)
VBAT: U1.VBAT

## Library data of the parts
25MHZ1 = ARVP:FA-238
C1-C7 C11 C12 C19 C20 C23 C24 C29 C30 C33 C35 C39 C44-C46 C48 C50-C62 C64 C66 C67 C69-C76 = rcl:C-EU: CAPACITOR, European symbol; SPICEPREFIX: C
C8-C10 C68 = Kondensatoren (rev17a):WCAP-AS5H: WCAP-AS5H Aluminum Electrolytic Capacitors Characteristics Aluminum Electrolytic Capacitor Recommended soldering: Reflow Operating temperature: -40 °C to +105 °C Long life product series Load life:5000 h @ +105 °C Package name and Variant abbreviation: Package: Package: B X C X A = length of the solder pad X width of the solder pad X pitch of the solder pad. <http://katalog.we-online.de/media/images/eisos/WCAP-AS5H_pf2.jpg> Details see: http://katalog.we-online.de/en/pbs/WCAP-AS5H?m Updated by: Yingchun,Shan Updated: 2017-03-16 2017 (C) Wurth Elektronik; WE-NUMBER: 865230340001/10uF
C13-C18 = rcl:C-US: CAPACITOR, American symbol; SPICEPREFIX: C
C21 C22 C36-C38 C40-C43 C47 C49 C63 C65 = resistor:C-EU: CAPACITOR, European symbol
C25-C28 C31 C32 C34 = adafruit:C-US: CAPACITOR, American symbol
CON4 = ARVP:MOLEX_5566-2
D1 D2 = Moira:MBRM120
D4 = diode:BAT54S: Schottky Diodes Pin connection corrected 2011-05-04 Source: Fairchild .. BAT54.pdf
H1-H4 TP1-TP13 = testpad:TP: Test pad
J1-J4 = ARVP:TE_5-1634503-1: BNC CONNECTOR M/A COM www.macom.com distributor Farnell 149-452
JP2 JP3 = pinhead-2:PINHD-1X03: PIN HEADER
JP4 JP7 = pinhead:PINHD-1X2: PIN HEADER
JP5 JP6 = pinhead:PINHD-1X1: PIN HEADER
JP8 = pinhead-2:PINHD-1X02: PIN HEADER
JP9 = pinhead:PINHD-1X7: PIN HEADER
L1 = Moira:LQH5BPN2R2N38L: 2.2uH
L2 = Moira:VLS5045EX-100M: VLS5045EX-100M, TDK 10uH, 445-174843-1-ND
L3 = Moira:VLS5045EX-150M-CA: VLS5045EX-150M-CA, TDK 15uH, 445-175141-1-ND
L4-L9 L11 L12 = resistor:L-US: INDUCTOR, American symbol
LED1 LED2 = led:LED: LED OSRAM: - CHIPLED LG R971, LG N971, LY N971, LG Q971, LY Q971, LO R971, LY R971 LH N974, LH R974 LS Q976, LO Q976, LY Q976 LO Q996 - Hyper CHIPLED LW Q18S LB Q993, LB Q99A, LB R99A - SideLED LS A670, LO A670, LY A670, LG A670, LP A670 LB A673, LV A673, LT A673, LW A673 LH A674 LY A675 LS A676, LA A676, LO A676, LY A676, LW A676 LS A679, LY A679, LG A679 - Hyper Micro SIDELED® LS Y876, LA Y876, LO Y876, LY Y876 LT Y87S - SmartLED LW L88C, LW L88S LB L89C, LB L89S, LG L890 LS L89K, LO L89K, LY L89K LS L896, LA L896, LO L896, LY L896 - TOPLED LS T670, LO T670, LY T670, LG T670, LP T670 LSG T670, LSP T670, LSY T670, LOP T670, LYG T670 LG T671, LOG T671, LSG T671 LB T673, LV T673, LT T673, LW T673 LH T674 LS T676, LA T676, LO T676, LY T676, LB T676, LH T676, LSB T676, LW T676 LB T67C, LV T67C, LT T67C, LS T67K, LO T67K, LY T67K, LW E67C LS E67B, LA E67B, LO E67B, LY E67B, LB E67C, LV E67C, LT E67C LW T67C LS T679, LY T679, LG T679 LS T770, LO T770, LY T770, LG T770, LP T770 LB T773, LV T773, LT T773, LW T773 LH T774 LS E675, LA E675, LY E675, LS T675 LS T776, LA T776, LO T776, LY T776, LB T776 LHGB T686 LT T68C, LB T68C - Hyper Mini TOPLED® LB M676 - Mini TOPLED Santana® LG M470 LS M47K, LO M47K, LY M47K Source: http://www.osram.convergy.de LUXEON: - LUMILED® LXK2-PW12-R00, LXK2-PW12-S00, LXK2-PW14-U00, LXK2-PW14-V00 LXK2-PM12-R00, LXK2-PM12-S00, LXK2-PM14-U00 LXK2-PE12-Q00, LXK2-PE12-R00, LXK2-PE12-S00, LXK2-PE14-T00, LXK2-PE14-U00 LXK2-PB12-K00, LXK2-PB12-L00, LXK2-PB12-M00, LXK2-PB14-N00, LXK2-PB14-P00, LXK2-PB14-Q00 LXK2-PR12-L00, LXK2-PR12-M00, LXK2-PR14-Q00, LXK2-PR14-R00 LXK2-PD12-Q00, LXK2-PD12-R00, LXK2-PD12-S00 LXK2-PH12-R00, LXK2-PH12-S00 LXK2-PL12-P00, LXK2-PL12-Q00, LXK2-PL12-R00 Source: www.luxeon.com KINGBRIGHT: KA-3528ASYC Source: www.kingbright.com
R1 R1A1 R1A2 R1B1 R1B2 R1C1 R1C2 R1D1 R1D2 R2 R2A1 R2A2 R2B1 R2B2 R2C1 R2C2 R2D1 R2D2 R3 R3A1 R3A2 R3B1 R3B2 R3C1 R3C2 R3D1 R3D2 R4-R19 R28-R34 R36-R41 RCLK1 RCLK2 = rcl:R-US_: RESISTOR, American symbol; SPICEPREFIX: R
R20-R27 = adafruit:R-US_: RESISTOR, American symbol
R35 = ARVP:RCT-0C: 0805 PROBE PAD; COMMENT: 1625854-2; DESCRIPTION: 0805 PROBE PAD; DIGI-KEY_PART_NUMBER: A106144CT-ND; DIGI-KEY_PURCHASE_URL: https://www.digikey.ca/product-detail/en/te-connectivity-amp-connectors/RCT-0C/A106144CT-ND/3477801?utm_source=snapeda&utm_medium=aggregator&utm_campaign=symbol; EU_ROHS_COMPLIANCE: Compliant; MF: TE Connectivity; MP: RCT-0C; PACKAGE: 0805; POWER_RATING: 0 W; RESISTANCE: <.05; TE_PURCHASE_URL: https://www.te.com/usa-en/product-1625854-2.html?te_bu=Cor&te_type=disp&te_campaign=seda_glo_cor-seda-global-disp-prtnr-fy19-seda-model-bom-cta_sma-317_1&elqCampaignId=32493; TOLERANCE: 0%
U1 = Teensy_3_Series_Board_v1.0:TEENSY_3.1_BASIC: Footprint for Teensy 3.1 board using all pin connections on the outer perimeter
U2 = ARVP:LTC6242IGNPBF
U3 U5 = ARVP:MCP1501
U4 = ARVP:AP7331-20WG-7
U6 = LTC6241:LTC6241
U7 U12 U13 U17 = Amplifier-Sonar-LBR:AD8336ACPZ-R7; MANUFACTURER_PART_NUMBER: AD8336ACPZR7; VENDOR: Analog Devices Inc
U8 = Moira:LT3471: LT3471EDD#TRPBF
U9 = Moira:LT1175: LT1175IS8#PBF
U10 = Moira:LT1117-5
U11 = MMBT3904:MMBT3904
U14-U16 U19 = hotfix:LTC6240
U18 = Amplifier-Sonar-Prototype-LBR:ISL21080DIH309Z-TK; MANUFACTURER_PART_NUMBER: ISL21080DIH309ZTK; VENDOR: Intersil
U$6 U$7 = ARVP:LTC1264
U$8 = ARVP:SI5351A

## Net classes
1 net1: clearance 0.203 mm to class 0